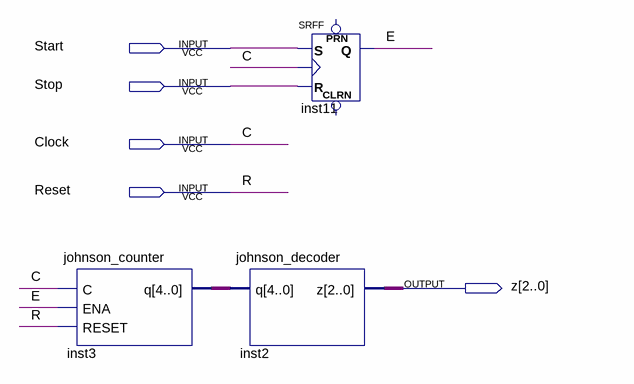
[diagram p0: schematic sheet]
// Quartus schematic scheme2.bdf as structural Verilog: 3 symbols, 5 pins
module scheme2 (
  input  Start,
  input  Stop,
  input  Clock,
  input  Reset,
  output [2:0] z
);

  wire E;
  wire [4:0] inst3_q;

  johnson_counter inst3 (.C(Clock), .ENA(E), .RESET(Reset), .q(inst3_q));
  johnson_decoder inst2 (.q(inst3_q), .z(z));
  SRFF inst11 (.S(Start), .R(Stop), .CLK(Clock), .Q(E));  // open: PRN, CLRN

  // Other names for the same wires on the sheet: C = Clock; R = Reset
endmodule
